# EAGLE design BLE112 Breakout Board v2.1 8mil (EAGLE 7.5.0)
BLE112 Breakout Board v2.0 Full breakout board for all BLE112 functions, with optional LEDs, programming header, USB access, etc.
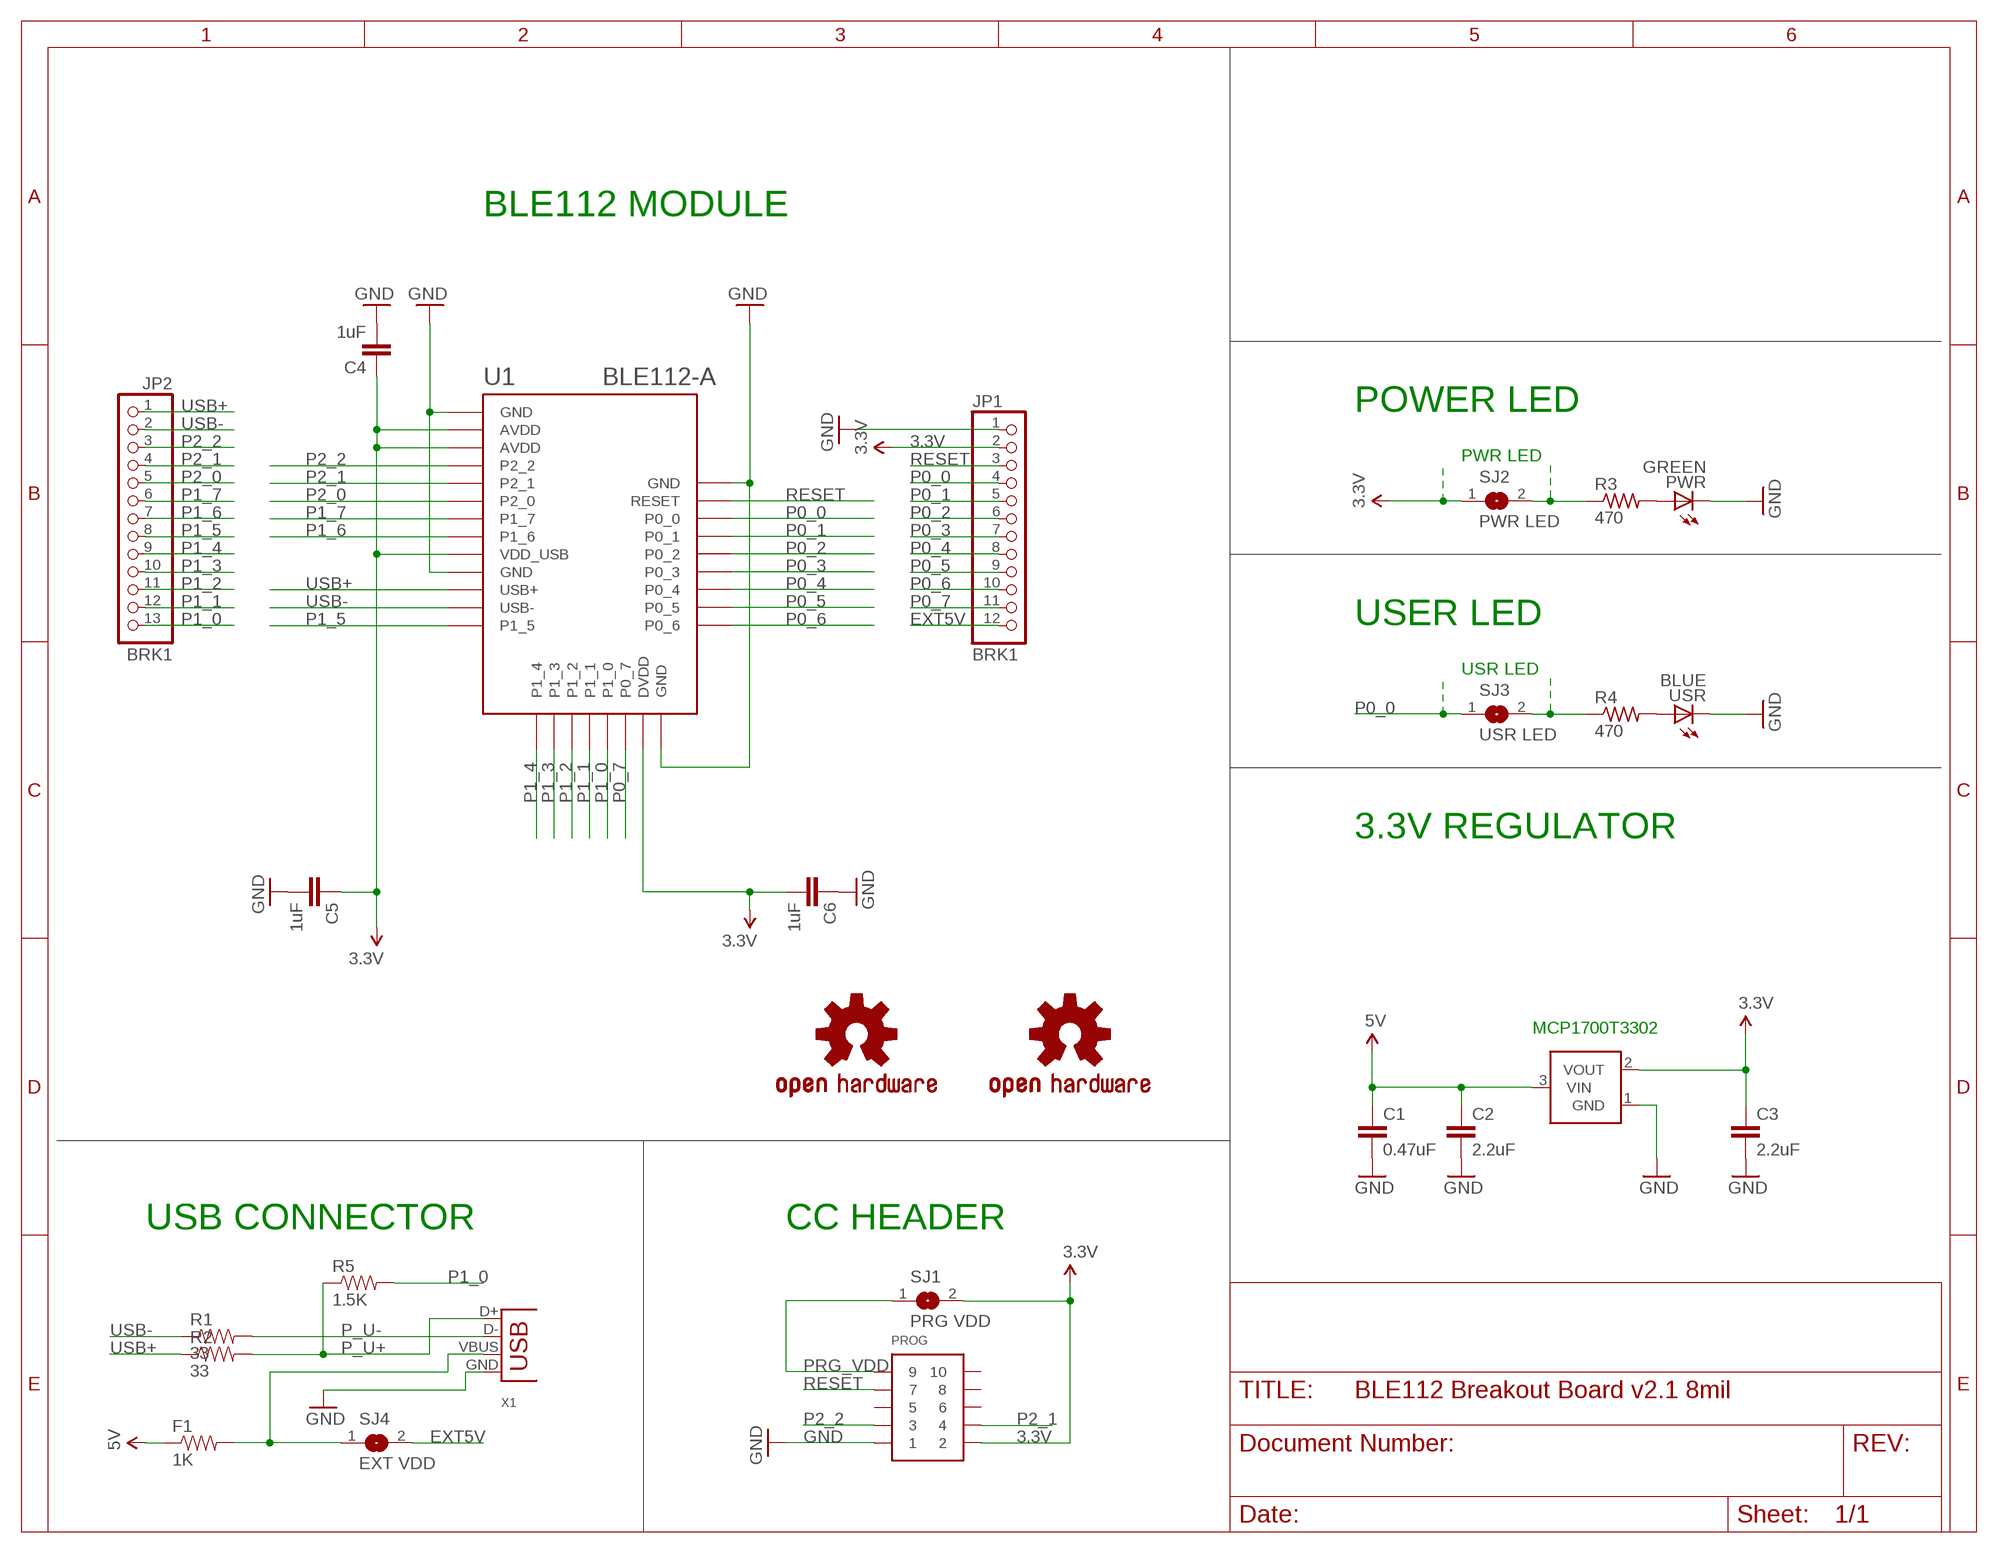
[diagram p0: schematic, sheet 1]

## Parts
C1  0.47uF  CAP0603-CAP  [0603-CAP]
C2  2.2uF  CAP0603-CAP  [0603-CAP]
C3  2.2uF  CAP0603-CAP  [0603-CAP]
C4  1uF  CAP0603-CAP  [0603-CAP]
C5  1uF  CAP0603-CAP  [0603-CAP]
C6  1uF  CAP0603-CAP  [0603-CAP]
F1  1K  RESISTOR0805-RES  [0805]
JP1  BRK1  PINHD-1X12  [1X12]
JP2  BRK1  PINHD-1X13  [1X13]
OSHW1  OSHW-LOGOL  [OSHW-LOGO-L]
OSHW2  OSHW-LOGOS  [OSHW-LOGO-S]
PROG  CONN_5-2-FTSH-V  [FTSH-105-DV]
PWR  GREEN  LEDCHIPLED_0805  [CHIPLED_0805]
R1  33  RESISTOR0603-RES  [0603-RES]
R2  33  RESISTOR0603-RES  [0603-RES]
R3  470  R-US_R0603  [R0603]
R4  470  R-US_R0603  [R0603]
R5  1.5K  RESISTOR0603-RES  [0603-RES]
SJ1  PRG VDD  SJ  [SJ]
SJ2  PWR LED  SJ  [SJ]
SJ3  USR LED  SJ  [SJ]
SJ4  EXT VDD  SJ  [SJ]
U1  BLE112-A  BLE112-A-VISUAL  [BLE112-A]
U2  MCP1700  [SOT23-3]
USR  BLUE  LEDCHIPLED_0805  [CHIPLED_0805]
X1  USB-MB-S  [USB-MB-S]

## Nets
3.3V: C3.1 C4.1 C5.1 C6.2 JP1.2 PROG.2 SJ1.2 SJ2.1 U1.AVDD1(AVDD) U1.AVDD2(AVDD) U1.DVDD U1.VDD_USB U2.2(VOUT)
5V: C1.1 C2.1 F1.1 U2.3(VIN)
EXT5V: JP1.12 SJ4.2
GND: C1.2 C2.2 C3.2 C4.2 C5.2 C6.1 JP1.1 PROG.1 PWR.C U1.GND1(GND) U1.GND2(GND) U1.GND3(GND) U1.GND4(GND) U2.1(GND) USR.C X1.GND
N$1: PWR.A R3.2
N$3: R3.1 SJ2.2
N$4: R4.2 USR.A
N$5: R4.1 SJ3.2
P0_0: JP1.4 SJ3.1 U1.P0_0
P0_1: JP1.5 U1.P0_1
P0_2: JP1.6 U1.P0_2
P0_3: JP1.7 U1.P0_3
P0_4: JP1.8 U1.P0_4
P0_5: JP1.9 U1.P0_5
P0_6: JP1.10 U1.P0_6
P0_7: JP1.11 U1.P0_7
P1_0: JP2.13 R5.2 U1.P1_0
P1_1: JP2.12 U1.P1_1
P1_2: JP2.11 U1.P1_2
P1_3: JP2.10 U1.P1_3
P1_4: JP2.9 U1.P1_4
P1_5: JP2.8 U1.P1_5
P1_6: JP2.7 U1.P1_6
P1_7: JP2.6 U1.P1_7
P2_0: JP2.5 U1.P2_0
P2_1: JP2.4 PROG.4 U1.P2_1
P2_2: JP2.3 PROG.3 U1.P2_2
P_U+: R2.2 R5.1 X1.D+
P_U-: R1.2 X1.D-
PRG_VDD: PROG.9 SJ1.1
RESET: JP1.3 PROG.7 U1.RESET
USB+: JP2.1 R2.1 U1.USB+
USB-: JP2.2 R1.1 U1.USB-
VBUS: F1.2 SJ4.1 X1.VBUS
Unconnected: PROG.5 PROG.6 PROG.8 PROG.10

## Notes on the sheet
- BLE112 MODULE
- POWER LED
- PWR LED
- USER LED
- USR LED
- 3.3V REGULATOR
- MCP1700T3302
- USB CONNECTOR | CC HEADER

## Library data of the parts
C1-C6 = SparkFun:CAP: Capacitor Standard 0603 ceramic capacitor, and 0.1" leaded capacitor.
F1 R1 R2 R5 = SparkFun:RESISTOR: Resistor Basic schematic elements and footprints for 0603, 1206, and PTH resistors.
JP1 = sf-pinhead:PINHD-1X12: PIN HEADER
JP2 = sf-pinhead:PINHD-1X13: PIN HEADER
OSHW1 OSHW2 = SparkFun:OSHW-LOGO: Open Source Hardware Logo This logo indicates the piece of hardware it is found on incorporates a OSHW license and/or adheres to the definition of open source hardware found here: http://freedomdefined.org/OSHW
PROG = pel_misc:CONN_5-2
PWR USR = led:LED: LED OSRAM: - CHIPLED LG R971, LG N971, LY N971, LG Q971, LY Q971, LO R971, LY R971 LH N974, LH R974 LS Q976, LO Q976, LY Q976 LO Q996 - Hyper CHIPLED LW Q18S LB Q993, LB Q99A, LB R99A - SideLED LS A670, LO A670, LY A670, LG A670, LP A670 LB A673, LV A673, LT A673, LW A673 LH A674 LY A675 LS A676, LA A676, LO A676, LY A676, LW A676 LS A679, LY A679, LG A679 - Hyper Micro SIDELED® LS Y876, LA Y876, LO Y876, LY Y876 LT Y87S - SmartLED LW L88C, LW L88S LB L89C, LB L89S, LG L890 LS L89K, LO L89K, LY L89K LS L896, LA L896, LO L896, LY L896 - TOPLED LS T670, LO T670, LY T670, LG T670, LP T670 LSG T670, LSP T670, LSY T670, LOP T670, LYG T670 LG T671, LOG T671, LSG T671 LB T673, LV T673, LT T673, LW T673 LH T674 LS T676, LA T676, LO T676, LY T676, LB T676, LH T676, LSB T676, LW T676 LB T67C, LV T67C, LT T67C, LS T67K, LO T67K, LY T67K, LW E67C LS E67B, LA E67B, LO E67B, LY E67B, LB E67C, LV E67C, LT E67C LW T67C LS T679, LY T679, LG T679 LS T770, LO T770, LY T770, LG T770, LP T770 LB T773, LV T773, LT T773, LW T773 LH T774 LS E675, LA E675, LY E675, LS T675 LS T776, LA T776, LO T776, LY T776, LB T776 LHGB T686 LT T68C, LB T68C - Hyper Mini TOPLED® LB M676 - Mini TOPLED Santana® LG M470 LS M47K, LO M47K, LY M47K Source: http://www.osram.convergy.de LUXEON: - LUMILED® LXK2-PW12-R00, LXK2-PW12-S00, LXK2-PW14-U00, LXK2-PW14-V00 LXK2-PM12-R00, LXK2-PM12-S00, LXK2-PM14-U00 LXK2-PE12-Q00, LXK2-PE12-R00, LXK2-PE12-S00, LXK2-PE14-T00, LXK2-PE14-U00 LXK2-PB12-K00, LXK2-PB12-L00, LXK2-PB12-M00, LXK2-PB14-N00, LXK2-PB14-P00, LXK2-PB14-Q00 LXK2-PR12-L00, LXK2-PR12-M00, LXK2-PR14-Q00, LXK2-PR14-R00 LXK2-PD12-Q00, LXK2-PD12-R00, LXK2-PD12-S00 LXK2-PH12-R00, LXK2-PH12-S00 LXK2-PL12-P00, LXK2-PL12-Q00, LXK2-PL12-R00 Source: www.luxeon.com KINGBRIGHT: KA-3528ASYC Source: www.kingbright.com
R3 R4 = resistor:R-US_: RESISTOR, American symbol
SJ1-SJ4 = jumper:SJ: SMD solder JUMPER
U1 = sf-bluegiga:BLE112-A-VISUAL: Bluetooth Low Energy single-mode module - Bluetooth 4.0, chip antenna
U2 = nonolith:MCP1700: Voltage regulator
X1 = con-usb-3:USB: USB Connectors

## Net classes
0 default: width 0.203 mm, drill 0.3 mm, clearance 0.203 mm

## Board
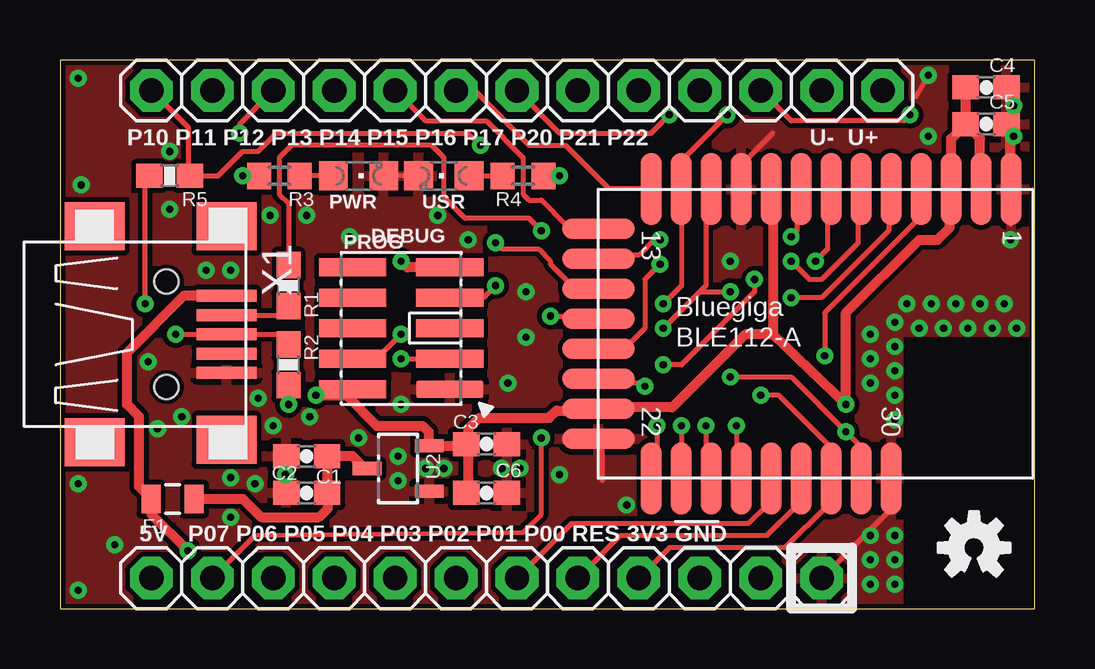
[diagram p1: board, top side]
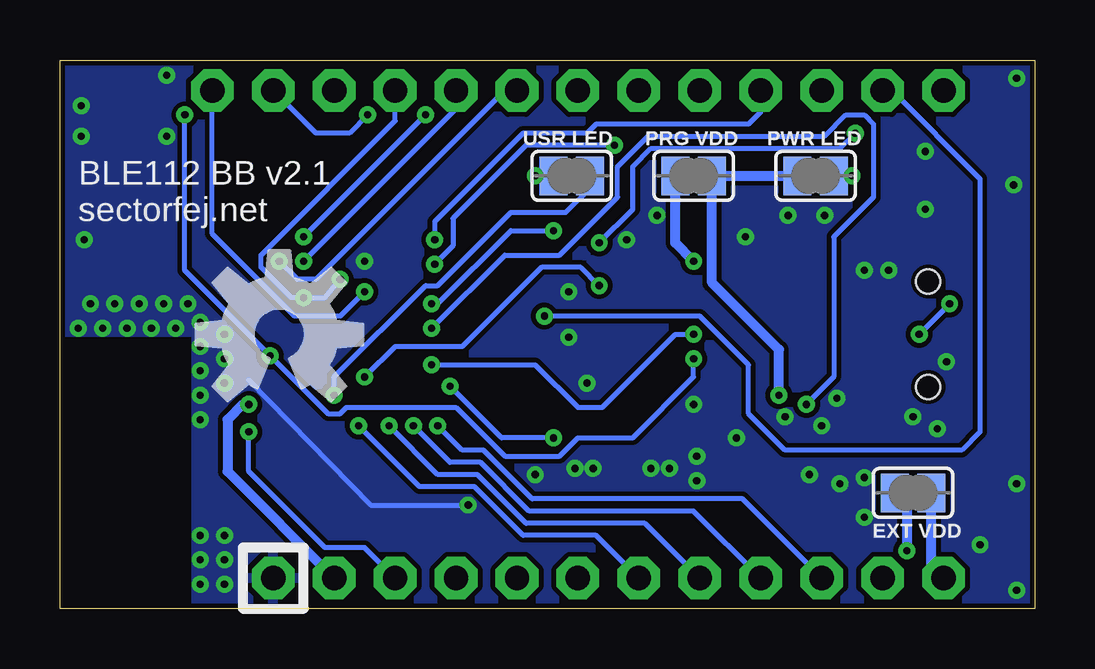
[diagram p2: board, bottom side, seen from below]

Size 40.64 x 22.86 mm. Coordinates in mm from the lower left corner, seen from the top.
Outline: 0,0 40.64,0 40.64,22.86 0,22.86 0,0
Copper layers (1*16): Top 0.035mm / dielectric 1.5mm / Bottom 0.035mm
Design rules "default *": minimum track width 8mil, minimum drill 0.3mm, track to track 8mil, track to pad 8mil, pad to pad 8mil, via to via 8mil, smd to smd 0mil, copper to edge 8mil, drill to drill 8mil, minimum pad ring 10mil, minimum via ring 8mil, stop-mask expansion 4mil, vias tented up to drill 0.3mm, thermal gap 10mil
tRestrict: area 35.2,0 to 40.6,11.3
bRestrict: area 35.2,0 to 40.6,11.3
vRestrict: area 2.8,19.3 to 35.3,20.1; area 3,2.8 to 33,3.6

### Footprints (pad centres in the part's own frame; a part is rotated, then mirrored left to right if it is on the bottom)
0603-CAP = smd 1.1 x 1: 1 -0.85,0; 2 0.85,0
0805 = smd 0.8 x 1.2: 1 -0.9,0; 2 0.9,0
1X12 = drill 1.016 pad 1.778 octagon: 1 -13.97,0; 2 -11.43,0; 3 -8.89,0; 4 -6.35,0; 5 -3.81,0; 6 -1.27,0; 7 1.27,0; 8 3.81,0; 9 6.35,0; 10 8.89,0; 11 11.43,0; 12 13.97,0
1X13 = drill 1.016 pad 1.778 octagon: 1 -15.24,0; 2 -12.7,0; 3 -10.16,0; 4 -7.62,0; 5 -5.08,0; 6 -2.54,0; 7 0,0; 8 2.54,0; 9 5.08,0; 10 7.62,0; 11 10.16,0; 12 12.7,0; 13 15.24,0
FTSH-105-DV = smd 0.74 x 2.8: 1 -2.54,-2.03; 2 -2.54,2.03; 3 -1.27,-2.03; 4 -1.27,2.03; 5 0,-2.03; 6 0,2.03; 7 1.27,-2.03; 8 1.27,2.03; 9 2.54,-2.03; 10 2.54,2.03
CHIPLED_0805 = smd 1.2 x 1.2: A 0,-1.05; C 0,1.05
0603-RES = smd 1.1 x 1: 1 -0.85,0; 2 0.85,0
R0603 = smd 1 x 1.1: 1 -0.85,0; 2 0.85,0
SJ = smd 1.168 x 1.6: 1 -0.762,0; 2 0.762,0
BLE112-A = smd 3 x 0.85: AVDD1 -6.05,6.9; AVDD2 -6.05,5.65; GND1 -6.05,8.15; GND2 -6.05,-3.1; GND4 6,3.15; P0_0 6,0.65; P0_1 6,-0.6; P0_2 6,-1.85; P0_3 6,-3.1; P0_4 6,-4.35; P0_5 6,-5.6; P0_6 6,-6.85; P1_5 -6.05,-6.85; P1_6 -6.05,-0.6; P1_7 -6.05,0.65; P2_0 -6.05,1.9; P2_1 -6.05,3.15; P2_2 -6.05,4.4; RESET 6,1.9; USB+ -6.05,-4.35; USB- -6.05,-5.6; VDD_USB -6.05,-1.85 | smd 0.85 x 3: DVDD 3.1,-9.05; GND3 4.35,-9.05; P0_7 1.85,-9.05; P1_0 0.6,-9.05; P1_1 -0.65,-9.05; P1_2 -1.9,-9.05; P1_3 -3.15,-9.05; P1_4 -4.4,-9.05
SOT23-3 = smd 0.55 x 1.2: 1 0.95,1.3; 2 -0.95,1.3; 3 0,-1.3
USB-MB-S = smd 2.5 x 0.5: D+ 2.5,0; D- 2.5,0.8; GND 2.5,-1.6; ID 2.5,-0.8; VBUS 2.5,1.6 | smd 2.5 x 2: P$1 -3,-4.5; P$2 -3,4.5; P$3 2.5,-4.4; P$4 2.5,4.5 | hole 1: 0,2.2; 0,-2.2

### Placement (x,y rotation side)
C1  10.29,6.35 180 top
C2  10.29,4.83 180 top
C3  17.78,6.86 0 top
C4  38.61,21.72 0 top
C5  38.61,20.19 0 top
C6  17.78,4.83 180 top
F1  4.7,4.57 180 top
JP1  17.78,1.27 180 top
JP2  19.05,21.59 180 top
OSHW1  31.5,11.43 0 bottom
OSHW2  38.1,2.54 0 top
PROG  14.22,11.68 90 top
PWR  12.45,18.03 270 top
R1  9.53,13.46 270 top
R2  9.53,10.16 90 top
R3  9.14,18.03 0 top
R4  19.3,18.03 180 top
R5  4.57,18.03 0 top
SJ1  14.22,18.03 0 bottom
SJ2  9.14,18.03 0 bottom
SJ3  19.3,18.03 180 bottom
SJ4  5.08,4.83 0 bottom
U1  31.5,11.43 270 top
U2  14.1,5.84 270 top
USR  16,18.03 90 top
X1  4.45,11.43 0 top

### Tracks (layer width: path | path; a pad name or v marks a point on that pad's centre or on a via)
3.3V  (via drill 0.3)
  Top 0.203: 17.02,4.83 C6.2 | PROG.2 11.94,8.89 PROG.2 | 38.35,17.53 U1.AVDD1 | 22.61,8.38 U1.DVDD | 29.72,17.27 U1.VDD_USB | 37.08,17.27 U1.AVDD2 | 17.02,6.86 C3.1 | 11.94,8.89 PROG.2
  Top 0.406: 17.02,4.83 17.02,6.86 17.02,7.49 17.47,7.95 20.39,7.95 20.7,8.26 22.37,8.26 U1.DVDD | 11.94,8.89 13.21,7.62 15.11,7.62 15.37,7.37 15.37,6.82 U2.2 16.86,6.79 C3.1 | 22.61,8.38 25.53,8.38 28.57,11.43 29.72,11.43 | 29.72,17.27 29.72,11.43 | 29.72,11.43 v32.77,8.51 32.77,12.32 35.81,15.37 36.58,15.37 37.08,15.88 37.08,17.27 | v10.67,8.89 11.94,8.89 | U1.AVDD2 37.15,19.58 C5.1 | 38.35,17.53 38.35,19.6 C5.1 | C5.1 C4.1
  Bottom 0.406: SJ2.1 SJ1.2 13.46,13.59 10.67,10.79 v10.67,8.89 | JP1.2 33.66,5.71 33.66,7.87 33.02,8.51 v32.77,8.51
5V
  Top 0.406: U2.3 12.7,5.84 12.19,6.35 C1.1 C2.1 11.18,4.79 11.18,4.19 10.8,3.81 8.38,3.81 7.62,4.57 F1.1
EXT5V
  Bottom 0.406: SJ4.2 4.32,1.78 JP1.12
GND  (via drill 0.3)
  Top 0.203: 21.08,7.11 22.35,7.11 U1.GND3 22.61,6.86 22.61,5.33 | USR.C PWR.C | 29.72,19.81 28.45,18.54 28.45,17.53 U1.GND2 | 39.62,18.54 39.62,17.53 U1.GND1 | JP1.1 34.54,4.06 34.54,5.33 U1.GND4 34.8,5.59 | 39.62,16 39.62,17.27 U1.GND1 | v36.2,22.23 35.69,21.34 | 39.88,17.53 U1.GND1
  Top 0.406: 39.62,18.54 39.62,20.03 C5.2
  Bottom 0.203: v23.62,4.32 27.69,4.32 32.77,9.53
  other vias: 39.88,11.68 38.86,11.68 37.85,11.68 36.83,11.68 35.81,11.68 34.8,10.92 34.8,9.91 34.8,8.89 34.8,7.87 34.8,3.05 34.8,2.03 34.8,1.02 6.1,14.1 7.11,14.1 4.06,7.49 5.08,8 14.22,8.51 20.83,5.59 10.29,16.38 27.94,14.48 39.37,12.7 38.35,12.7 37.34,12.7 36.32,12.7 33.78,10.41 33.78,9.4 33.78,3.05 33.78,2.03 33.78,1.02 9.4,5.59 14.1,5.33 14.1,6.35 18.41,5.84 15.75,16.38 17.02,15.37 3.68,10.29 2.29,2.67 4.57,16.64 0.76,22.1 0.76,0.76 0.89,17.65 4.57,19.05 7.11,3.81 0.76,5.21 8.76,16.38 12.07,15.49 35.31,12.7 34.8,11.94 33.78,11.43 19.18,5.84 15.24,5.84 16,5.84 10.41,8 8.25,8.76 8.13,5.21 12.45,7.11 8.89,7.62 7.11,5.46 18.67,9.4 19.43,11.3 19.43,13.21 39.62,15.37 39.75,20.95 39.75,19.68 36.2,19.68
  pour Top: 0,22.86 40.64,22.86 40.64,0 0,0
  pour Bottom: 0,22.86 40.64,22.86 40.64,0 0,0
N$1
  Top 0.203: PWR.A R3.2
N$3  (via drill 0.3)
  Top 0.203: v7.62,18.03 R3.1 SJ2.2
  Bottom 0.203: SJ2.2 v7.62,18.03
N$4
  Top 0.203: USR.A R4.2
N$5  (via drill 0.3)
  Top 0.203: v20.83,18.03 R4.1
  Bottom 0.203: SJ3.2 v20.83,18.03
N$6
  Bottom 0.203: 8.64,18.03 9.65,18.03
N$8
  Bottom 0.203: 18.8,18.03 19.81,18.03
N$9
  Bottom 0.203: 13.72,18.03 14.73,18.03
N$10
  Bottom 0.203: 4.57,4.83 5.59,4.83
P0_0  (via drill 0.3)
  Top 0.203: v29.21,8.89 29.97,8.89 32,6.86 32,5.59 U1.P0_0 32,5.33 32,4.32 30.23,2.54 25.4,2.54 JP1.4
  Bottom 0.203: SJ3.1 18.54,17.53 19.56,16.51 21.84,16.51 24.89,13.46 25.4,13.46 29.21,9.65 v29.21,8.89
P0_1
  Top 0.203: JP1.5 23.37,3.05 29.46,3.05 30.73,4.32 30.73,5.33 U1.P0_1
P0_2
  Top 0.203: JP1.6 21.34,3.56 28.7,3.56 29.46,4.32 29.46,5.33 U1.P0_2
P0_3  (via drill 0.3)
  Top 0.203: v28.19,7.62 28.19,5.59 U1.P0_3
  Bottom 0.203: v28.19,7.62 25.65,5.08 23.37,5.08 21.34,3.05 18.29,3.05 JP1.7
P0_4  (via drill 0.3)
  Top 0.203: v26.92,7.62 26.92,5.59 U1.P0_4
  Bottom 0.203: v26.92,7.62 24.89,5.59 23.24,5.59 21.21,3.56 16.26,3.56 JP1.8
P0_5  (via drill 0.3)
  Top 0.203: v25.91,7.62 25.91,5.59 U1.P0_5
  Bottom 0.203: v25.91,7.62 24.38,6.1 23.11,6.1 21.08,4.06 14.22,4.06 JP1.9
P0_6  (via drill 0.3)
  Top 0.203: v24.89,7.62 24.89,5.59 U1.P0_6
  Bottom 0.203: v24.89,7.62 23.88,6.6 22.99,6.6 20.95,4.57 12.19,4.57 JP1.10
P0_7  (via drill 0.3)
  Top 0.203: v24.38,9.27 24.26,9.4 22.61,9.4 U1.P0_7 | v20.07,7.11 20.07,3.94 19.3,3.17 8.13,3.05 JP1.11
  Bottom 0.203: v24.38,9.27 22.22,7.11 v20.07,7.11
P1_0  (via drill 0.3)
  Top 0.203: JP2.13 5.33,20.07 5.33,18.03 R5.2 6.6,18.03 7.62,19.05 8.25,19.05 9.02,19.81 17.02,19.81 v17.53,19.3 | v25.02,14.35 24.38,13.72 24.38,11.68 23.62,10.92 22.61,10.92 U1.P1_0
  Bottom 0.203: v25.02,14.35 24.26,15.11 24.26,16.26 21.21,19.3 v17.53,19.3
P1_1  (via drill 0.3)
  Top 0.203: v20.45,12.19 22.35,12.19 U1.P1_1
  Bottom 0.203: v20.45,12.19 13.97,12.19 11.94,10.16 11.94,8.13 10.41,6.6 3.05,6.6 2.29,7.37 2.29,17.91 5.97,21.59 JP2.12
P1_2  (via drill 0.3)
  Top 0.203: v18.16,15.24 18.41,14.99 19.94,14.99 20.45,14.48 20.45,14.35 21.34,13.46 22.35,13.46 U1.P1_2 | v7.49,19.81 7.49,20.19 JP2.11
  Bottom 0.203: v18.16,15.24 16.76,16.64 16.76,18.41 16,19.18 8.13,19.18 v7.49,19.81
P1_3  (via drill 0.3)
  Top 0.203: v25.02,15.37 24.77,15.37 24.13,14.73 22.61,14.73 U1.P1_3
  Bottom 0.203: v25.02,15.37 25.02,16.13 21.34,19.81 18.67,19.81 18.29,20.19 11.94,20.19 11.43,20.7 JP2.10
P1_4
  Top 0.203: JP2.9 15.24,20.32 17.78,20.32 19.3,18.8 19.3,17.27 19.56,17.02 20.07,17.02 21.08,16 22.35,16 U1.P1_4
P1_5
  Top 0.203: JP2.8 17.27,21.59 19.56,19.3 21.08,19.3 22.86,17.53 24.64,17.53 U1.P1_5
P1_6  (via drill 0.3)
  Top 0.203: v30.48,15.49 30.73,15.75 30.73,17.27 U1.P1_6 | v25.4,20.57 24.64,19.81 20.83,19.81 JP2.7
  Bottom 0.203: v25.4,20.57 v30.48,15.49
P1_7  (via drill 0.3)
  Top 0.203: v31.5,14.48 32,14.99 32,17.27 U1.P1_7
  Bottom 0.203: v31.5,14.48 30.73,13.72 29.97,13.72 22.1,21.59 JP2.6
P2_0  (via drill 0.3)
  Top 0.203: v30.48,14.48 31.24,13.72 31.75,13.72 33.27,15.24 33.27,17.27 U1.P2_0
  Bottom 0.203: v30.48,14.48 24.13,20.83 JP2.5
P2_1  (via drill 0.3)
  Top 0.203: PROG.4 13.21,10.41 v14.22,11.43 | v25.15,10.16 25.91,10.16 28.96,13.21 v28.96,13.72 | v30.48,12.95 31.75,12.95 34.54,15.75 34.54,17.27 U1.P2_1
  Bottom 0.203: v14.22,11.43 14.99,11.43 18.03,8.38 19.05,8.38 20.83,10.16 v25.15,10.16 | v28.96,13.72 29.59,12.95 v30.48,12.95 30.99,12.95 32.26,14.22 32.26,14.73 26.67,20.32 JP2.4
P2_2  (via drill 0.3)
  Top 0.203: v14.22,10.41 PROG.3 | v31.88,10.54 31.88,12.32 35.81,16.26 35.81,17.27 U1.P2_2 | JP2.3 30.48,20.32 35.18,20.32 v35.43,20.57
  Bottom 0.203: v14.22,10.41 14.22,9.65 16.76,7.11 19.05,7.11 19.81,6.35 22.1,6.35 24.13,8.38 28.7,8.38 28.96,8.13 29.46,8.13 v31.88,10.54 35.43,14.1 v35.43,20.57
P_U+  (via drill 0.3)
  Top 0.203: v3.56,12.7 3.56,18.03 R5.1 | 9.53,11.18 R2.2 9.53,11.43 X1.D+ v4.83,11.43
  Bottom 0.203: v3.56,12.7 v4.83,11.43
P_U-
  Top 0.203: 9.53,12.45 R1.2 9.53,12.23 X1.D-
PRG_VDD  (via drill 0.3)
  Top 0.406: v14.22,14.48 14.48,14.22 PROG.9
  Bottom 0.406: SJ1.1 14.99,15.24 v14.22,14.48
RESET  (via drill 0.3)
  Top 0.203: U1.RESET 33.27,5.59 33.27,6.86 v32.77,7.37 30.48,9.65 v27.94,9.65 | v18.16,13.46 17.65,12.95 PROG.7
  Bottom 0.203: JP1.3 27.94,2.54 29.59,2.54 32.77,5.71 v32.77,7.37 | v18.16,13.46 18.92,14.22 20.57,14.22 23.88,10.92 26.67,10.92 v27.94,9.65
USB+  (via drill 0.3)
  Top 0.203: v9.53,8.51 R2.1 9.53,9.4 | 26.67,13.21 26.92,13.46 26.92,17.27 U1.USB+ | 26.67,13.21 v25.15,11.68 | 26.67,13.21 v27.94,13.21
  Bottom 0.203: v25.15,11.68 22.1,14.73 19.81,14.73 17.4,17.14 17.4,18.41 16.13,19.68 8.76,19.68 7.87,20.57 7.11,20.57 6.73,20.19 6.73,17.14 8.38,15.49 8.38,9.65 v9.53,8.51 | JP2.1 34.29,15.62 30.86,12.19 28.96,12.19 v27.94,13.21
USB-  (via drill 0.3)
  Top 0.203: R1.1 9.53,16.89 9.14,17.27 9.14,18.8 9.65,19.3 15.49,19.3 16,18.8 16,17.14 16.89,16.26 19.56,16.26 v20.07,15.75 | v25.15,12.7 25.91,13.46 25.91,17.27 U1.USB- 25.91,17.53 25.91,18.67 v27.81,20.57
  Bottom 0.203: v20.07,15.75 21.84,15.75 24.89,12.7 v25.15,12.7 | JP2.2 29.97,19.81 28.57,19.81 v27.81,20.57
VBUS  (via drill 0.3)
  Top 0.203: 3.81,3.94 F1.2
  Top 0.406: v5.33,2.41 3.81,3.94 | F1.2 3.3,5.08 3.3,8 2.79,8.51 2.79,10.67 5.16,13.03 X1.VBUS
  Bottom 0.406: v5.33,2.41 5.33,4.32 SJ4.1

### Text on the board
tPlace: P10 P11 P12 P13 P14 P15 P16 P17 P20 P21 P22 | U- U+ | DEBUG | Bluegiga | BLE112-A | 5V | P07 P06 P05 P04 P03 P02 P01 P00 RES 3V3 GND
bPlace: PWR LED | PRG VDD | USR LED | BLE112 BB v2.1 | sectorfej.net | EXT VDD